# EAGLE design receiver (EAGLE 9.6.2)
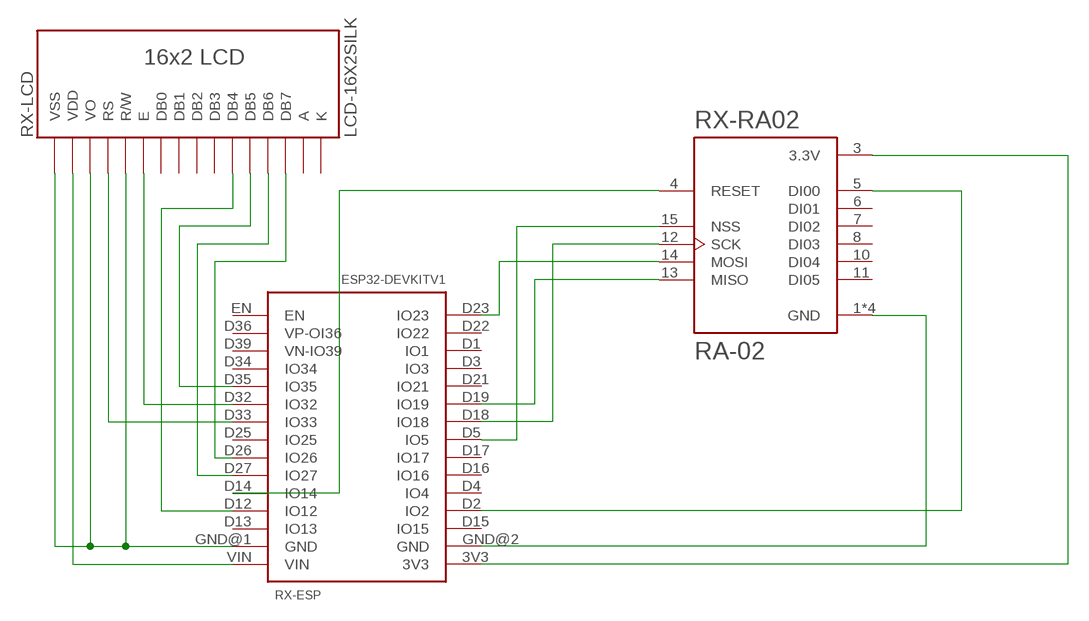
[diagram p0: schematic, sheet 1]

## Parts
RX-ESP  ESP32DEVKITV1  [ESP32-DEVKITV1]
RX-LCD  LCD-16X2SILK  [MODULE_LCD-16X2]
RX-RA02  RA-02  [RA-02]

## Nets
N$2: RX-ESP.D23(IO23) RX-RA02.14(MOSI)
N$3: RX-ESP.D2(IO2) RX-RA02.5(DI00)
N$5: RX-ESP.GND@2(GND) RX-RA02.1(GND) RX-RA02.2(GND) RX-RA02.9(GND) RX-RA02.16(GND)
N$6: RX-ESP.D19(IO19) RX-RA02.13(MISO)
N$7: RX-ESP.D18(IO18) RX-RA02.12(SCK)
N$8: RX-ESP.D5(IO5) RX-RA02.15(NSS)
N$9: RX-ESP.D14(IO14) RX-RA02.4(RESET)
N$10: RX-ESP.3V3 RX-RA02.3(3.3V)
N$11: RX-ESP.VIN RX-LCD.2(VDD)
N$12: RX-ESP.D32(IO32) RX-LCD.6(E)
N$13: RX-ESP.D33(IO33) RX-LCD.4(RS)
N$14: RX-ESP.D27(IO27) RX-LCD.13(DB6)
N$15: RX-ESP.D35(IO35) RX-LCD.12(DB5)
N$16: RX-ESP.D12(IO12) RX-LCD.11(DB4)
RX-N$1: RX-ESP.D26(IO26) RX-LCD.14(DB7)
RX-N$4: RX-ESP.GND@1(GND) RX-LCD.1(VSS) RX-LCD.3(VO) RX-LCD.5(R/W)
Unconnected: RX-ESP.D1(IO1) RX-ESP.D3(IO3) RX-ESP.D4(IO4) RX-ESP.D13(IO13) RX-ESP.D15(IO15) RX-ESP.D16(IO16) RX-ESP.D17(IO17) RX-ESP.D21(IO21) RX-ESP.D22(IO22) RX-ESP.D25(IO25) RX-ESP.D34(IO34) RX-ESP.D36(VP-OI36) RX-ESP.D39(VN-IO39) RX-ESP.EN RX-LCD.7(DB0) RX-LCD.8(DB1) RX-LCD.9(DB2) RX-LCD.10(DB3) RX-RA02.6(DI01) RX-RA02.7(DI02) RX-RA02.8(DI03) RX-RA02.10(DI04) RX-RA02.11(DI05)

## Power pins joined to a net without a drawn wire
A: RX-LCD.15(A)
K: RX-LCD.16(K)

## Library data of the parts
RX-ESP = ESP32-DEVKITV1:ESP32DEVKITV1
RX-LCD = LCD-16X2:LCD-16X2: Check availability <https://pricing.snapeda.com/parts/LCD-16X2/Gravitech/view-part?ref=eda>; AVAILABILITY: Not in stock; CHECK_PRICES: https://www.snapeda.com/parts/LCD-16X2/Gravitech/view-part/?ref=eda; DESCRIPTION: Display Development Tools 16x2 Black on Green Char LCD w Backlight; MF: Gravitech; MP: LCD-16X2; PACKAGE: None; PRICE: None; SNAPEDA_LINK: https://www.snapeda.com/parts/LCD-16X2/Gravitech/view-part/?ref=snap
RX-RA02 = RA-02:RA-02: Check availability <https://pricing.snapeda.com/parts/RA-02/Ai-Thinker/view-part?ref=eda>; AVAILABILITY: In Stock; CHECK_PRICES: https://www.snapeda.com/parts/RA-02/AI-Thinker/view-part/?ref=eda; DESCRIPTION: General ISM < 1GHz LoRa™ Transceiver Module 410MHz ~ 525MHz Antenna Not Included, I-PEX Surface Mount; MF: Ai-Thinker; MP: RA-02; PACKAGE: None; PRICE: None; SNAPEDA_LINK: https://www.snapeda.com/parts/RA-02/AI-Thinker/view-part/?ref=snap

## Board
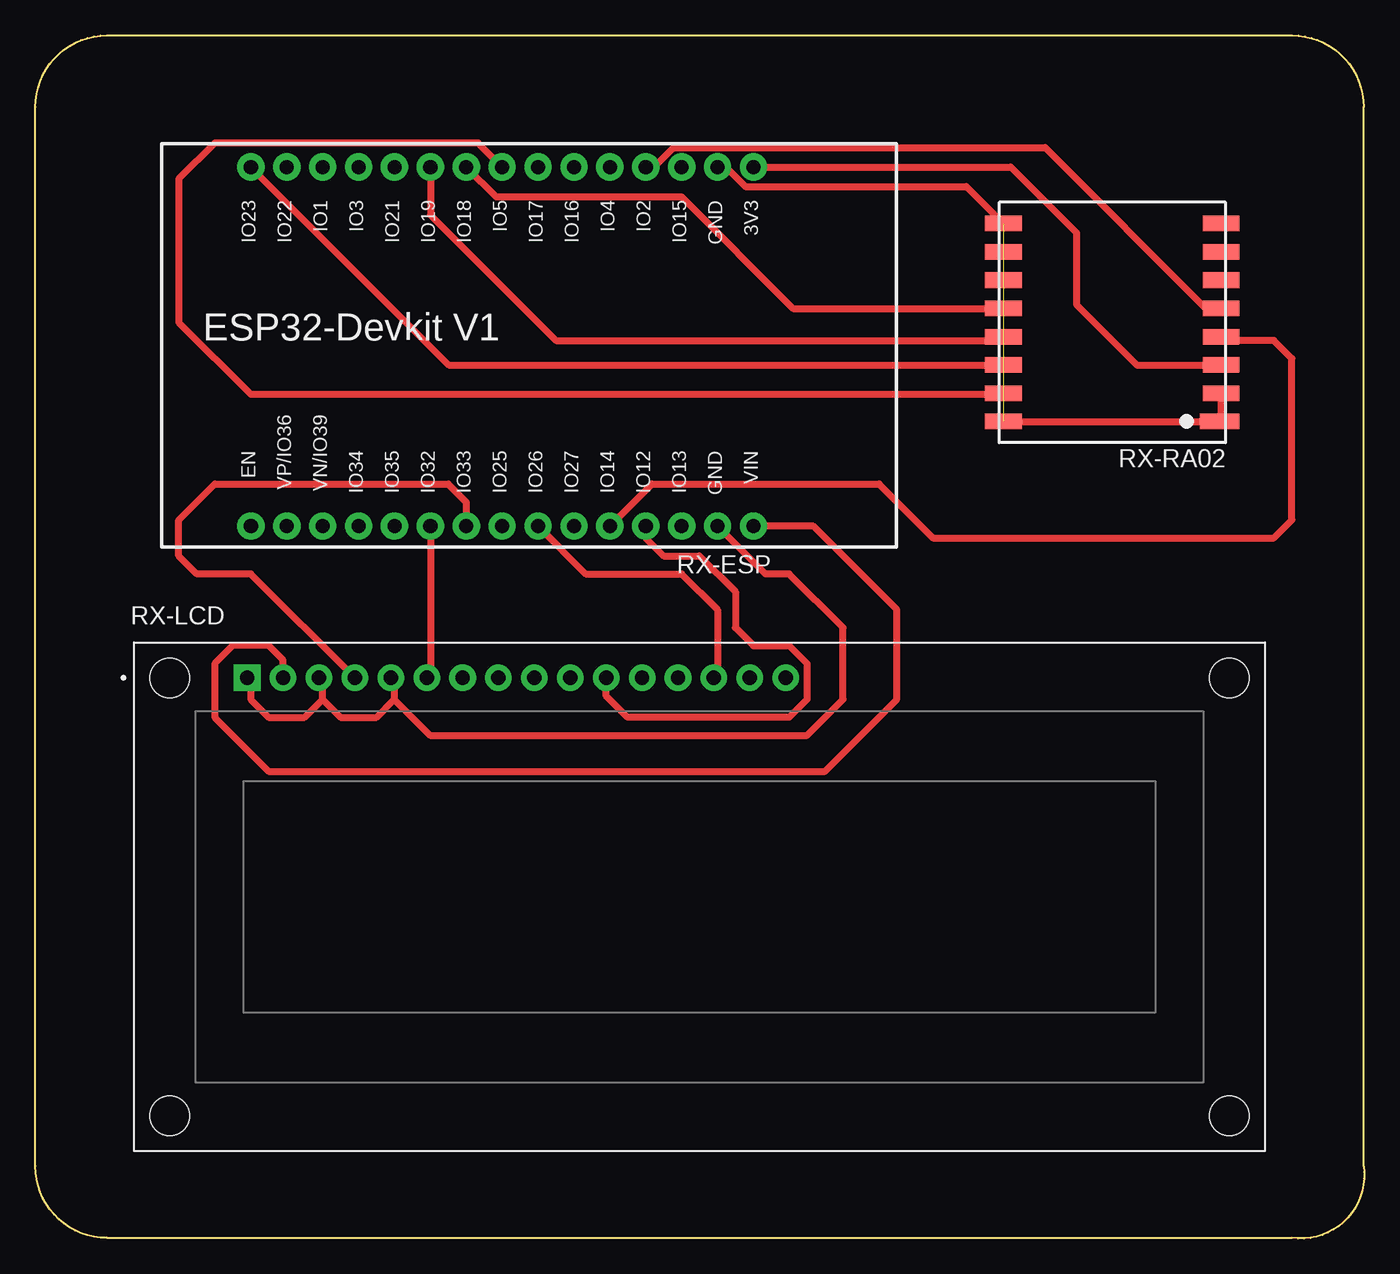
[diagram p1: board, top side]
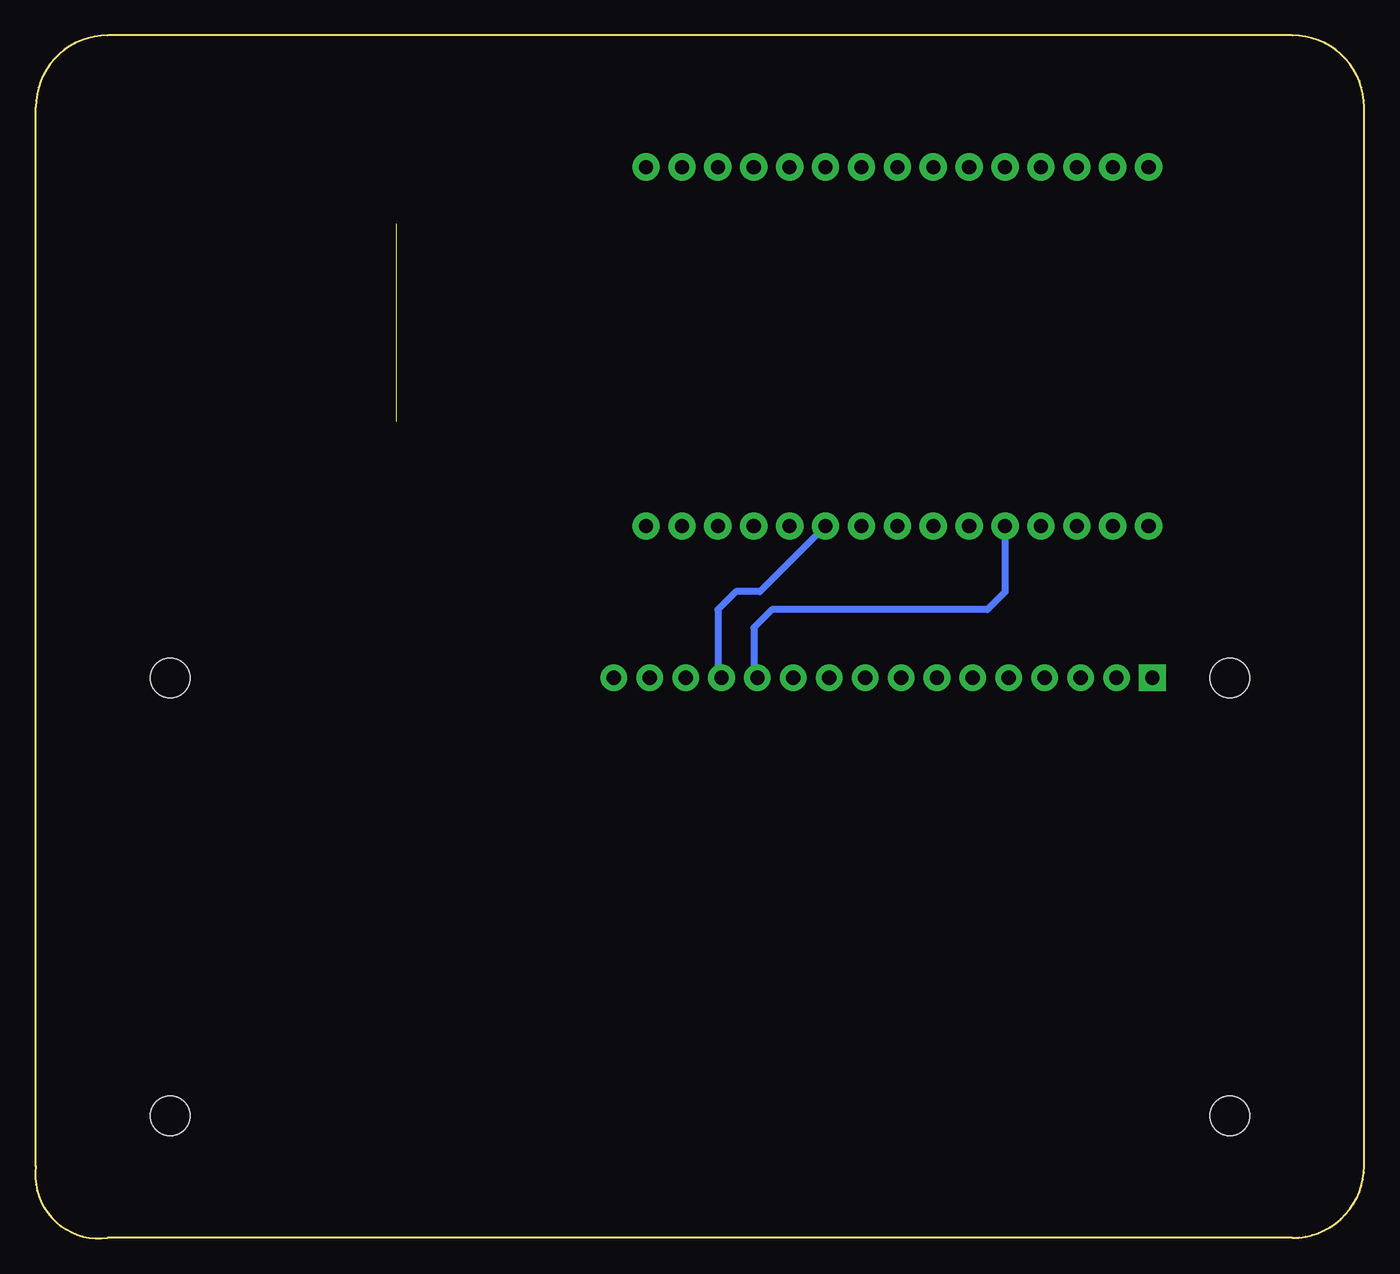
[diagram p2: board, bottom side, seen from below]

Size 94.02 x 85.13 mm. Coordinates in mm from the lower left corner, seen from the top.
Outline: 0,5.12 0,80.05 arc-90 5.08,85.13 88.9,85.13 arc-90 93.98,80.05 93.98,5.12 arc-106 88.9,0.04 5.08,0.04 arc-90 0,5.12
Copper layers (1*16): Top 0.035mm / dielectric 1.5mm / Bottom 0.035mm
Design rules "default": minimum track width 6mil, minimum drill 0.35mm, track to track 6mil, track to pad 6mil, pad to pad 6mil, via to via 6mil, smd to smd 6mil, copper to edge 40mil, drill to drill 6mil, minimum pad ring 10mil, minimum via ring 8mil, stop-mask expansion 4mil, vias tented up to drill 0mil, thermal gap 10mil

### Footprints (pad centres in the part's own frame; a part is rotated, then mirrored left to right if it is on the bottom)
ESP32-DEVKITV1 = drill 1 pad 1.93: 3V3 -16.52,-12.27; D1 13.96,-12.27; D2 -8.9,-12.27; D3 11.42,-12.27; D4 -6.36,-12.27; D5 1.26,-12.27; D12 -8.9,13.135; D13 -11.44,13.135; D14 -6.36,13.135; D15 -11.44,-12.27; D16 -3.82,-12.27; D17 -1.28,-12.27; D18 3.8,-12.27; D19 6.34,-12.27; D21 8.88,-12.27; D22 16.5,-12.27; D23 19.04,-12.27; D25 1.26,13.135; D26 -1.28,13.135; D27 -3.82,13.135; D32 6.34,13.135; D33 3.8,13.135; D34 11.42,13.135; D35 8.88,13.135; D36 16.5,13.135; D39 13.96,13.135; EN 19.04,13.135; GND@1 -13.98,13.135; GND@2 -13.98,-12.27; VIN -16.52,13.135
MODULE_LCD-16X2 = drill 1.016 pad 1.88 square: 1 -32,15.5 | drill 1.016 pad 1.88: 2 -29.46,15.5; 3 -26.92,15.5; 4 -24.38,15.5; 5 -21.84,15.5; 6 -19.3,15.5; 7 -16.76,15.5; 8 -14.22,15.5; 9 -11.68,15.5; 10 -9.14,15.5; 11 -6.6,15.5; 12 -4.06,15.5; 13 -1.52,15.5; 14 1.02,15.5; 15 3.56,15.5; 16 6.1,15.5 | hole 2.8: -37.5,15.5; -37.5,-15.5; 37.5,15.5; 37.5,-15.5
RA-02 = smd 2.8 x 1.1: 1 -7.6,7 | smd 2.6 x 1.1: 2 -7.7,5; 3 -7.7,3; 4 -7.7,1; 5 -7.7,-1; 6 -7.7,-3; 7 -7.7,-5; 8 -7.7,-7; 9 7.7,-7; 10 7.7,-5; 11 7.7,-3; 12 7.7,-1; 13 7.7,1; 14 7.7,3; 15 7.7,5; 16 7.7,7

### Placement (x,y rotation side)
RX-ESP  34.29,63.54 180 top
RX-LCD  46.99,24.17 0 top
RX-RA02  76.2,64.81 180 top

### Tracks (layer width: path | path; a pad name or v marks a point on that pad's centre or on a via)
N$2
  Top 0.508: RX-ESP.D23 29.25,61.81 RX-RA02.14
N$3
  Top 0.508: RX-ESP.D2 43.79,75.81 45.16,77.18 71.45,77.18 82.82,65.81 RX-RA02.5
N$5  (1 unrouted)
  Top 0.508: RX-RA02.16 RX-RA02.1 83.9,57.91 RX-RA02.2 | RX-ESP.GND@2 48.87,75.81 50.24,74.44 65.87,74.44 RX-RA02.9
N$6
  Top 0.508: RX-ESP.D19 27.95,72.42 36.83,63.54 68.23,63.54 RX-RA02.13
N$7
  Top 0.508: RX-ESP.D18 32.6,73.7 45.72,73.7 53.61,65.81 RX-RA02.12
N$8
  Top 0.508: RX-ESP.D5 31.33,77.51 12.7,77.51 10.16,74.97 10.16,64.81 15.24,59.73 68.42,59.73 RX-RA02.15
N$9
  Top 0.508: RX-ESP.D14 43.62,53.38 59.69,53.38 63.5,49.57 87.63,49.57 88.9,50.84 88.9,62.27 87.63,63.54 84.17,63.54 RX-RA02.4
N$10
  Top 0.508: RX-ESP.3V3 69.01,75.81 73.66,71.16 73.66,66.08 77.93,61.81 RX-RA02.3
N$11
  Top 0.508: RX-LCD.2 17.53,40.93 16.51,41.95 13.97,41.95 12.7,40.68 12.7,36.87 16.51,33.06 55.88,33.06 60.96,38.14 60.96,44.49 55.05,50.41 RX-ESP.VIN
N$12
  Top 0.508: RX-ESP.D32 27.95,39.93 RX-LCD.6
N$13
  Top 0.508: RX-LCD.4 15.25,47.03 11.43,47.03 10.16,48.3 10.16,50.84 12.7,53.38 29.21,53.38 30.49,52.1 RX-ESP.D33
N$14
  Bottom 0.508: RX-ESP.D27 42.76,45.76 44.45,45.76 45.72,44.49 45.72,39.92 RX-LCD.13
N$15
  Bottom 0.508: RX-ESP.D35 25.41,45.77 25.4,45.76 26.67,44.49 41.91,44.49 43.18,43.22 43.18,39.92 RX-LCD.12
N$16
  Top 0.508: RX-LCD.11 40.39,38.39 41.91,36.87 53.34,36.87 54.61,38.14 54.61,40.68 53.34,41.95 50.8,41.95 49.53,43.22 49.53,45.76 46.99,48.3 44.45,48.3 43.18,49.57 43.19,49.58 RX-ESP.D12
RX-N$1
  Top 0.508: RX-ESP.D26 38.95,47.03 45.72,47.03 48.26,44.49 48.26,39.92 RX-LCD.14
RX-N$4
  Top 0.508: RX-LCD.1 15.24,39.42 15.24,38.14 16.51,36.87 19.05,36.87 20.32,38.14 | 20.32,38.14 20.32,39.42 RX-LCD.3 | 20.32,38.14 21.59,36.87 24.13,36.87 25.4,38.14 | 25.4,38.14 25.4,39.42 RX-LCD.5 | 25.4,38.14 27.94,35.6 54.61,35.6 57.15,38.14 57.15,43.22 53.34,47.03 51.65,47.03 RX-ESP.GND@1